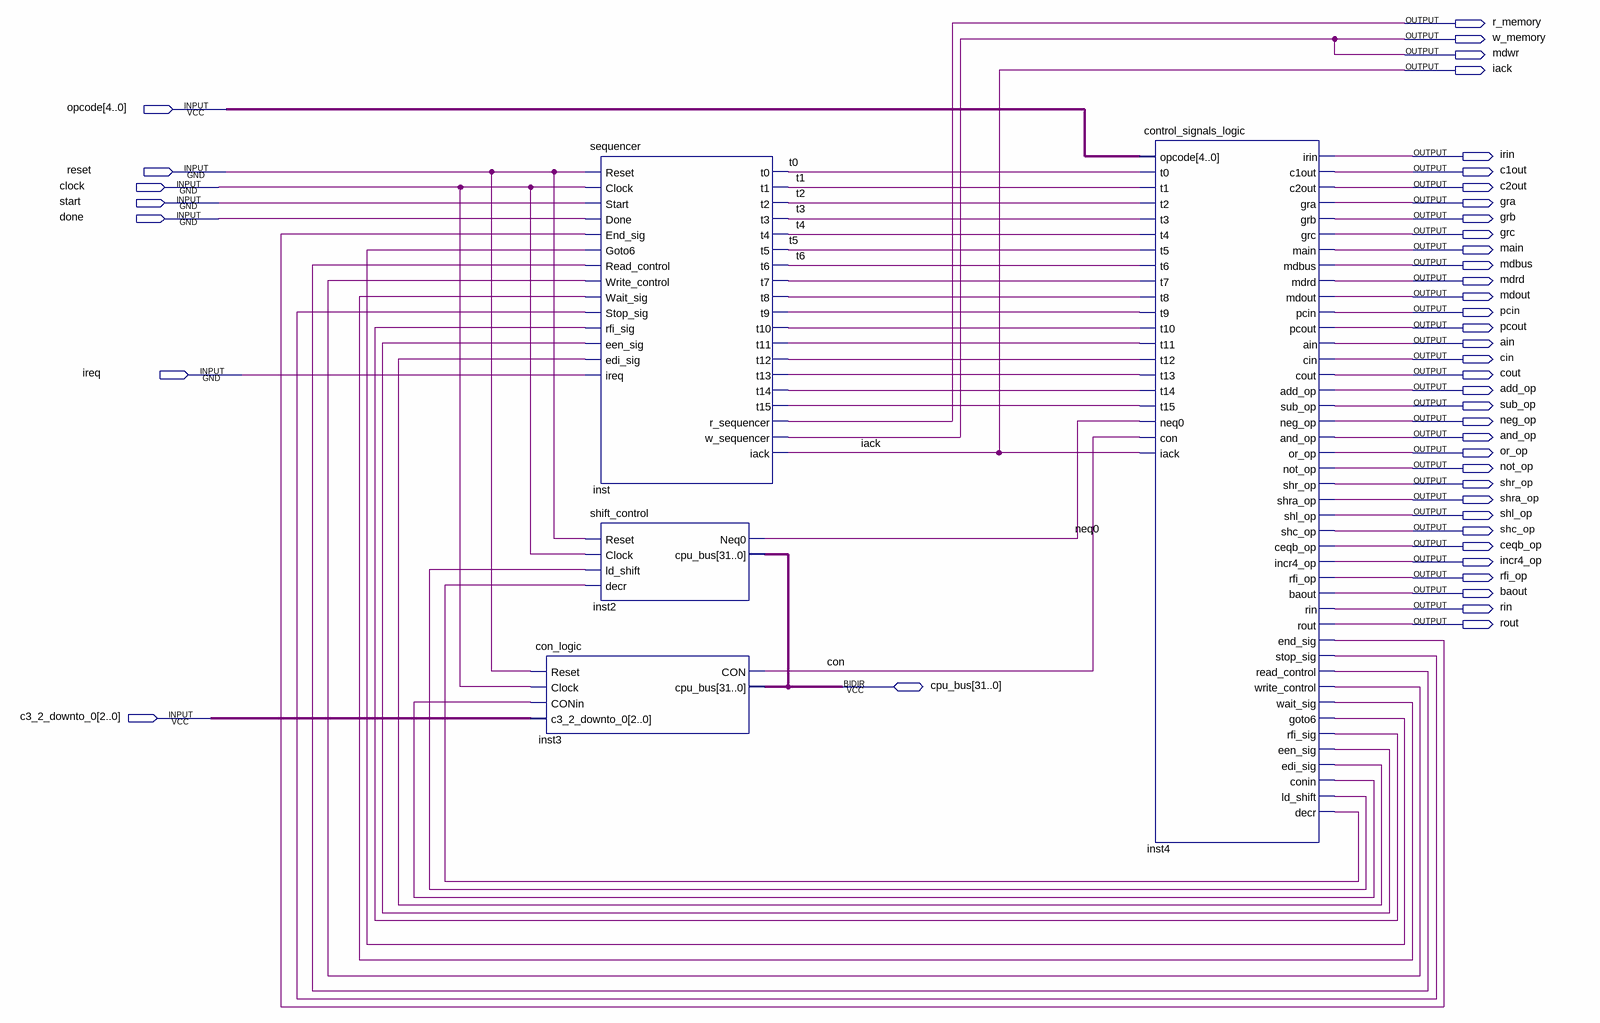
[diagram p0: schematic sheet]
// Quartus schematic control_unit.bdf as structural Verilog: 4 symbols, 43 pins
module control_unit (
  input  [4:0] opcode,
  input  reset,
  input  clock,
  input  start,
  input  done,
  input  ireq,
  input  [2:0] c3_2_downto_0,
  inout  [31:0] cpu_bus,
  output r_memory,
  output w_memory,
  output mdwr,
  output iack,
  output irin,
  output c1out,
  output c2out,
  output gra,
  output grb,
  output grc,
  output main,
  output mdbus,
  output mdrd,
  output mdout,
  output pcin,
  output pcout,
  output ain,
  output cin,
  output cout,
  output add_op,
  output sub_op,
  output neg_op,
  output and_op,
  output or_op,
  output not_op,
  output shr_op,
  output shra_op,
  output shl_op,
  output shc_op,
  output ceqb_op,
  output incr4_op,
  output rfi_op,
  output baout,
  output rin,
  output rout
);

  wire con, inst4_conin, inst4_decr, inst4_edi_sig, inst4_een_sig, inst4_end_sig, inst4_goto6,
       inst4_ld_shift, inst4_read_control, inst4_rfi_sig, inst4_stop_sig, inst4_wait_sig,
       inst4_write_control, inst_t7, inst_t8, inst_t9, inst_t10, inst_t11, inst_t12, inst_t13, inst_t14,
       inst_t15, neq0, t0, t1, t2, t3, t4, t5, t6;

  con_logic inst3 (
    .Reset(reset), .Clock(clock), .CONin(inst4_conin), .c3_2_downto_0(c3_2_downto_0), .CON(con),
    .cpu_bus(cpu_bus));
  sequencer inst (
    .Reset(reset), .Clock(clock), .Start(start), .Done(done), .End_sig(inst4_end_sig), .Goto6(inst4_goto6),
    .Read_control(inst4_read_control), .Write_control(inst4_write_control), .Wait_sig(inst4_wait_sig),
    .Stop_sig(inst4_stop_sig), .rfi_sig(inst4_rfi_sig), .een_sig(inst4_een_sig), .edi_sig(inst4_edi_sig),
    .ireq(ireq), .t0(t0), .t1(t1), .t2(t2), .t3(t3), .t4(t4), .t5(t5), .t6(t6), .t7(inst_t7), .t8(inst_t8),
    .t9(inst_t9), .t10(inst_t10), .t11(inst_t11), .t12(inst_t12), .t13(inst_t13), .t14(inst_t14),
    .t15(inst_t15), .r_sequencer(r_memory), .w_sequencer(mdwr), .iack(iack));
  shift_control inst2 (
    .Reset(reset), .Clock(clock), .ld_shift(inst4_ld_shift), .decr(inst4_decr), .Neq0(neq0), .cpu_bus(cpu_bus));
  control_signals_logic inst4 (
    .opcode(opcode), .t0(t0), .t1(t1), .t2(t2), .t3(t3), .t4(t4), .t5(t5), .t6(t6), .t7(inst_t7),
    .t8(inst_t8), .t9(inst_t9), .t10(inst_t10), .t11(inst_t11), .t12(inst_t12), .t13(inst_t13),
    .t14(inst_t14), .t15(inst_t15), .neq0(neq0), .con(con), .iack(iack), .irin(irin), .c1out(c1out),
    .c2out(c2out), .gra(gra), .grb(grb), .grc(grc), .main(main), .mdbus(mdbus), .mdrd(mdrd), .mdout(mdout),
    .pcin(pcin), .pcout(pcout), .ain(ain), .cin(cin), .cout(cout), .add_op(add_op), .sub_op(sub_op),
    .neg_op(neg_op), .and_op(and_op), .or_op(or_op), .not_op(not_op), .shr_op(shr_op), .shra_op(shra_op),
    .shl_op(shl_op), .shc_op(shc_op), .ceqb_op(ceqb_op), .incr4_op(incr4_op), .rfi_op(rfi_op), .baout(baout),
    .rin(rin), .rout(rout), .end_sig(inst4_end_sig), .stop_sig(inst4_stop_sig),
    .read_control(inst4_read_control), .write_control(inst4_write_control), .wait_sig(inst4_wait_sig),
    .goto6(inst4_goto6), .rfi_sig(inst4_rfi_sig), .een_sig(inst4_een_sig), .edi_sig(inst4_edi_sig),
    .conin(inst4_conin), .ld_shift(inst4_ld_shift), .decr(inst4_decr));

  assign w_memory = mdwr;
endmodule
